# Altium project ESP_Grow_Main_Rev_A.PrjPCB
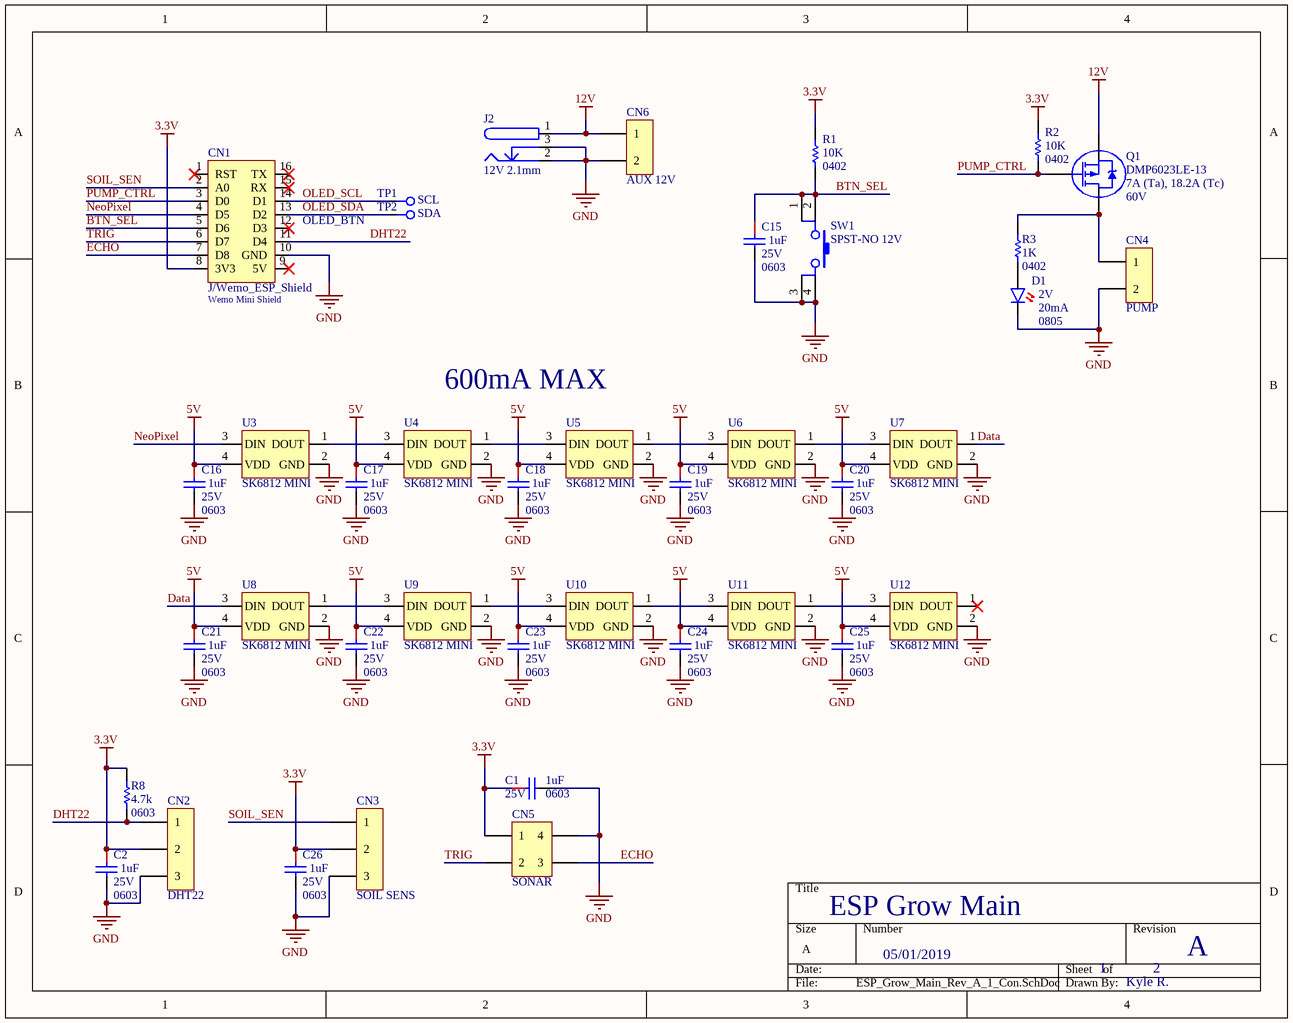
[diagram p0: ESP_Grow_Main_Rev_A_1_Con.SchDoc]
1 sheet, 40 parts. Net scope: global (net labels, ports and power ports of the same name join across sheets).
Board file: ESP_Grow_Main_Rev_A.PcbDoc

## Sheet ESP_Grow_Main_Rev_A_1_Con.SchDoc: ESP Grow Main
size A; Date: 05/01/2019; Author: Kyle R.; Revision: A; SheetNumber: 1; SheetTotal: 2

### Parts
C1  1uF  Voltage - Rated: 25V  Package / Case: 0603  [CAPC0603(1608)_N]
C2  1uF  Voltage - Rated: 25V  Package / Case: 0603  [CAPC0603(1608)_N]
C15  1uF  Voltage - Rated: 25V  Package / Case: 0603  [CAPC0603(1608)_N]
C16  1uF  Voltage - Rated: 25V  Package / Case: 0603  [CAPC0603(1608)_N]
C17  1uF  Voltage - Rated: 25V  Package / Case: 0603  [CAPC0603(1608)_N]
C18  1uF  Voltage - Rated: 25V  Package / Case: 0603  [CAPC0603(1608)_N]
C19  1uF  Voltage - Rated: 25V  Package / Case: 0603  [CAPC0603(1608)_N]
C20  1uF  Voltage - Rated: 25V  Package / Case: 0603  [CAPC0603(1608)_N]
C21  1uF  Voltage - Rated: 25V  Package / Case: 0603  [CAPC0603(1608)_N]
C22  1uF  Voltage - Rated: 25V  Package / Case: 0603  [CAPC0603(1608)_N]
C23  1uF  Voltage - Rated: 25V  Package / Case: 0603  [CAPC0603(1608)_N]
C24  1uF  Voltage - Rated: 25V  Package / Case: 0603  [CAPC0603(1608)_N]
C25  1uF  Voltage - Rated: 25V  Package / Case: 0603  [CAPC0603(1608)_N]
C26  1uF  Voltage - Rated: 25V  Package / Case: 0603  [CAPC0603(1608)_N]
CN1  J/Wemo_ESP_Shield  Name: Wemo Mini Shield  [Wemos_d1]
CN2  DHT22  [Molex 1x3 Microfit 90deg]
CN3  SOIL SENS  [Molex 1x3 Microfit 90deg]
CN4  PUMP  [Molex 1x2 Microfit 3.0]
CN5  SONAR  [Molex 2x2 Microfit 90deg]
CN6  AUX 12V  [Molex 1x2 Microfit 3.0]
D1  Voltage - Forward (Vf) (Typ): 2V  Current - Test: 20mA  Package / Case: 0805  [D/0805]  (hidden comment: D/LEDR/0805)
J2  12V 2.1mm  [CONN_PWR_JACK_2.1x5.5mm]
Q1  DMP6023LE-13  Current - Continuous Drain (Id) @ 25°C: 7A (Ta), 18.2A (Tc)  Drain to Source Voltage (Vdss): 60V  [SOT-223 - DMP6023LE]
R1  10K  Supplier Device Package: 0402  [RESC0402(1005)_N]
R2  10K  Supplier Device Package: 0402  [RESC0402(1005)_N]
R3  Package / Case: 0402  [RESC0402(1005)_L]  (hidden comment: 1K)
R8  Package / Case: 0603  [RESC0603(1608)_N]  (hidden comment: 4.7K)
SW1  SPST-NO 12V  [SW TACT Red 6mm x 6mm]
TP1  SCL  [Pogo-Testpoint]  (no BOM)
TP2  SDA  [Pogo-Testpoint]  (no BOM)
U3  SK6812 MINI  [SK6812_Mini]
U4  SK6812 MINI  [SK6812_Mini]
U5  SK6812 MINI  [SK6812_Mini]
U6  SK6812 MINI  [SK6812_Mini]
U7  SK6812 MINI  [SK6812_Mini]
U8  SK6812 MINI  [SK6812_Mini]
U9  SK6812 MINI  [SK6812_Mini]
U10  SK6812 MINI  [SK6812_Mini]
U11  SK6812 MINI  [SK6812_Mini]
U12  SK6812 MINI  [SK6812_Mini]

### Nets
3.3V: C1.1 C2.1 C26.1 CN1.8(3V3) CN2.2 CN3.2 CN5.1 R1.2 R2.2 R8.2
5V: C16.1 C17.1 C18.1 C19.1 C20.1 C21.1 C22.1 C23.1 C24.1 C25.1 U3.4(VDD) U4.4(VDD) U5.4(VDD) U6.4(VDD) U7.4(VDD) U8.4(VDD) U9.4(VDD) U10.4(VDD) U11.4(VDD) U12.4(VDD)
12V: CN6.1 J2.1 Q1.S
GND: C1.2 C2.2 C15.2 C16.2 C17.2 C18.2 C19.2 C20.2 C21.2 C22.2 C23.2 C24.2 C25.2 C26.2 CN1.10(GND) CN2.3 CN3.3 CN4.2 CN5.4 CN6.2 D1.1 J2.2 J2.3 SW1.3 SW1.4 U3.2(GND) U4.2(GND) U5.2(GND) U6.2(GND) U7.2(GND) U8.2(GND) U9.2(GND) U10.2(GND) U11.2(GND) U12.2(GND)
BTN_SEL: C15.1 CN1.5(D6) R1.1 SW1.1 SW1.2
Data: U7.1(DOUT) U8.3(DIN)
DHT22: CN1.11(D4) CN2.1 R8.1
ECHO: CN1.7(D8) CN5.3
NeoPixel: CN1.4(D5) U3.3(DIN)
OLED_SCL: CN1.14(D1) TP1.1
OLED_SDA: CN1.13(D2) TP2.1
PUMP_CTRL: CN1.3(D0) Q1.G R2.1
SOIL_SEN: CN1.2(A0) CN3.1
TRIG: CN1.6(D7) CN5.2
NetCN4_1: CN4.1 Q1.D R3.2
NetD1_2: D1.2 R3.1
NetU3_1: U3.1(DOUT) U4.3(DIN)
NetU4_1: U4.1(DOUT) U5.3(DIN)
NetU5_1: U5.1(DOUT) U6.3(DIN)
NetU6_1: U6.1(DOUT) U7.3(DIN)
NetU8_1: U8.1(DOUT) U9.3(DIN)
NetU9_1: U9.1(DOUT) U10.3(DIN)
NetU10_1: U10.1(DOUT) U11.3(DIN)
NetU11_1: U11.1(DOUT) U12.3(DIN)

Not connected (* = marked no-connect by the designer): CN1 1(RST)* 9(5V)* 12(D3)* 15(RX)* 16(TX)*; U12 1(DOUT)*

### Notes on the sheet
- (near CN1) OLED_BTN
- 600mA MAX

### Library data of the parts
C1 C2 C15-C26 = CAP CER 1UF 25V 10% X7R 0603: 1uF 0603 25V; Manufacturer: TDK Corporation; Manufacturer Part Number: CGA3E1X7R1E105K080AC; Tolerance: ±10%; Temperature Coefficient: X7R; Supplier 1: Digi-Key; RoHS: RoHS Compliant; Category: Capacitors; Stock 1: 360610; Pricing 1: 1=0.2, 10=0.135, 100=0.0686, 500=0.04696, 1000=0.04154 (USD); Packaging: Cut Tape (CT); Part Status: Active; Operating Temperature: -55°C ~ 125°C; Features: -; Ratings: AEC-Q200; Applications: Automotive; Failure Rate: -; Mounting Type: Surface Mount, MLCC; Size / Dimension: 0.063" L x 0.032" W (1.60mm x 0.80mm); Height - Seated (Max): -; Thickness (Max): 0.035" (0.90mm); Lead Spacing: -; Lead Style: -; ComponentLink1URL: https://product.tdk.com/info/en/catalog/datasheets/mlcc_automotive_general_en.pdf; ComponentLink1Description: https://product.tdk.com/info/en/catalog/datasheets/mlcc_automotive_general_en.pdf; Supplier Part Number 1: 445-6931-1-ND
CN1 = J/Wemo_ESP_Shield: Wemo Mini Shield for ESP-12
CN2 CN3 = MICROFIT 3.0 HDR 90deg 3CKT: Molex Microfit 1x3 90deg Header; Manufacturer: Molex Inc; Manufacturer Part Number: 0436500304; Connector Type: Header, Shrouded; Number of Positions: 3; Number of Positions Loaded: All; Pitch: 0.118" (3.00mm); ClassName: *; Supplier 1: Digi-Key; RoHS: RoHS Compliant; Category: Connectors, Interconnects; Stock 1: 42564; Pricing 1: 1=1.39, 10=1.224, 50=1.104, 100=1.056, 250=0.96, 500=0.864, 1000=0.768, 2500=0.696, 5000=0.672 (USD); Packaging: Tray; Contact Type: Male Pin; Number of Rows: 1; Row Spacing: -; Contact Mating Length: -; Mounting Type: Through Hole, Right Angle; Termination: Solder; Fastening Type: Locking Ramp; Features: Board Lock; Contact Finish: Gold; Contact Finish Thickness: 15µin (0.38µm); Color: Black; ComponentLink1URL: http://www.molex.com/pdm_docs/sd/436500304_sd.pdf; ComponentLink1Description: http://www.molex.com/pdm_docs/sd/436500304_sd.pdf; Supplier Part Number 1: WM1876-ND
CN4 CN6 = MICROFIT 3.0 HDR VERT CPI 2CKT: Molex Microfit 1x2 Vert Header; Manufacturer: Molex, LLC; Manufacturer Part Number: 0430450227; Shrouding: Shrouded - 4 Wall; Number of Positions: 2; Number of Positions Loaded: All; Row Spacing: 0.118" (3.00mm); Supplier 1: Digi-Key; RoHS: RoHS Compliant; Category: Connectors, Interconnects; Stock 1: 4002; Pricing 1: 1=0.8, 10=0.705, 50=0.636, 100=0.6083, 250=0.553, 500=0.4977, 1000=0.4424, 2500=0.40092, 5000=0.3871 (USD); Packaging: Tray; Part Status: Active; Connector Type: Header; Contact Type: Male Pin; Pitch: -; Number of Rows: 2; Mounting Type: Through Hole; Termination: Solder; Fastening Type: Locking Ramp; Contact Mating Length: -; Features: Board Guide; Contact Finish: Tin; Contact Finish Thickness: 60µin (1.52µm); Color: Black; ComponentLink1URL: http://www.molex.com/pdm_docs/sd/430450227_sd.pdf; ComponentLink1Description: http://www.molex.com/pdm_docs/sd/430450227_sd.pdf; Supplier Part Number 1: WM10657-ND
CN5 = MICROFIT 3.0 HDR 90deg 4CKT: Molex Microfit 2x2 90deg Header; Manufacturer: Molex Inc; Manufacturer Part Number: 0430450400; Connector Type: Header, Shrouded; Number of Positions: 4; Number of Positions Loaded: All; Pitch: 0.118" (3.00mm); ClassName: *; Supplier 1: Digi-Key; RoHS: RoHS Compliant; Category: Connectors, Interconnects; Stock 1: 9668; Pricing 1: 1=1.35, 10=1.228, 50=1.1026, 100=1.0525, 250=0.95228, 500=0.8771, 1000=0.7518, 2500=0.70168, 5000=0.6666 (USD); Packaging: Tray; Contact Type: Male Pin; Number of Rows: 2; Row Spacing: 0.118" (3.00mm); Contact Mating Length: -; Mounting Type: Through Hole, Right Angle; Termination: Solder; Fastening Type: Locking Ramp; Features: Board Lock; Contact Finish: Tin; Contact Finish Thickness: 100µin (2.54µm); Color: Black; ComponentLink1URL: http://www.molex.com/pdm_docs/sd/430450400_sd.pdf; ComponentLink1Description: http://www.molex.com/pdm_docs/sd/430450400_sd.pdf; Supplier Part Number 1: WM1814-ND
D1 = D/LEDR/0805: Red 625nm LED Indication - Discrete 2V 0805; Digikey Part: 732-4984-1-ND; Cost: 0.23; Supplier 1: Digi-Key; Supplier Part Number 1: 732-4984-6-ND
J2 = CONN PWR JACK 2.1: 2.1 mm barrel jack; Manufacturer: CUI Inc; Manufacturer Part Number: PJ-002A; Gender: Male; Plug/Mating Plug Diameter: 2.1mm ID, 5.5mm OD; Number of Positions/Contacts: 2 Conductors, 3 Contacts; Internal Switch(s): Single Switch, Normally Closed; Shielding: Unshielded; Voltage - Rated: 16VDC; Current Rating: 2.5A; Published: 17-Dec-2003; DatasheetDocument: 09-May-2002; Publisher: Altium Limited; ComponentLink1Description: Manufacturer Link; ComponentLink1URL: http://domino.kycon.com/internet/Products.html; RoHS: RoHS Compliant; Category: Connectors, Interconnects; Connector Type: Jack; Mounting Type: Through Hole, Right Angle; Termination: Solder Eyelet(s); Features: -; Color: Black; Contact Material: Copper Alloy; Contact Material - Plating: Tin; Housing Color: Black; Housing Material: Thermoplastic; Operating Temperature: -25°C ~ 85°C; ComponentLink2URL: http://www.cui.com/product/resource/digikeypdf/pj-002a.pdf; ComponentLink2Description: http://www.cui.com/product/resource/digikeypdf/pj-002a.pdf; Supplier 1: Digi-Key; Stock 1: 47553; Pricing 1: 1=1.01, 10=0.704, 100=0.4724, 500=0.3819, 1000=0.3417, 2500=0.27135 (USD); ComponentLink3URL: http://www.cui.com/product/resource/digikeypdf/pj-002ah.pdf; ComponentLink3Description: http://www.cui.com/product/resource/digikeypdf/pj-002ah.pdf; Supplier Part Number 1: CP-002AH-ND
Q1 = DMP6023LE-13: MOSFET P-CH 60V 7A SOT223; Manufacturer: Diodes Incorporated; FET Type: P-Channel; Drive Voltage (Max Rds On,  Min Rds On): 4.5V, 10V; Vgs(th) (Max) @ Id: 3V @ 250µA; Vgs (Max): ±20V; Power Dissipation (Max): 2W (Ta); Rds On (Max) @ Id, Vgs: 28 mOhm @ 5A, 10V; Supplier 1: Digi-Key; Manufacturer Part Number: DMP6023LE-13; RoHS: RoHS Compliant; Category: Discrete Semiconductor Products; Stock 1: 16540; Pricing 1: 1=0.95, 10=0.829, 100=0.6396, 500=0.4738, 1000=0.37904 (USD); Packaging: Cut Tape (CT); Part Status: Active; Technology: MOSFET (Metal Oxide); FET Feature: -; Operating Temperature: -55°C ~ 150°C (TJ); Mounting Type: Surface Mount; Supplier Device Package: SOT-223; Package / Case: TO-261-4, TO-261AA; ComponentLink1URL: https://www.diodes.com/assets/Datasheets/DMP6023LE.pdf; ComponentLink1Description: https://www.diodes.com/assets/Datasheets/DMP6023LE.pdf; Supplier Part Number 1: DMP6023LE-13DICT-ND
R1 R2 = RES 10K OHM 1% 1/16W 0402: 10K 0402; Manufacturer: Samsung Electro-Mechanics; Manufacturer Part Number: RC1005F103CS; Tolerance: ±1%; Power (Watts): 0.063W, 1/16W; Temperature Coefficient: ±100ppm/°C; Supplier 1: Digi-Key; RoHS: RoHS Compliant; Category: Resistors; Stock 1: 25834562; Pricing 1: 1=0.1, 10=0.021, 100=0.0086, 1000=0.00385, 2500=0.00334, 5000=0.00276 (USD); Packaging: Cut Tape (CT); Part Status: Active; Composition: Thick Film; Features: Moisture Resistant; Operating Temperature: -55°C ~ 155°C; Package / Case: 0402 (1005 Metric); Size / Dimension: 0.039" L x 0.020" W (1.00mm x 0.50mm); Height - Seated (Max): 0.016" (0.40mm); Failure Rate: -; ComponentLink1URL: http://www.samsungsem.com/kr/support/product-search/chip-resistor/RC1005F103CS.jsp; ComponentLink1Description: http://www.samsungsem.com/kr/support/product-search/chip-resistor/RC1005F103CS.jsp; Supplier Part Number 1: 1276-3431-1-ND
R3 = RES 1K OHM 1% 1/16W 0402: 1K 0402; Manufacturer: Yageo; Manufacturer Part Number: RC0402FR-071KL; Tolerance: 1%; Temperature Coefficient: 100ppm/°C; Power Rating: 62.5mW; Voltage Rating: 50V; ComponentLink1URL: https://datasheet.ciiva.com/2453/pyu-r-int-thick-7-2453361.pdf; ComponentLink1Description: https://datasheet.ciiva.com/2453/pyu-r-int-thick-7-2453361.pdf; ComponentLink2URL: https://datasheet.ciiva.com/2453/pyu-r-int-thick-7-2453362.pdf; ComponentLink2Description: https://datasheet.ciiva.com/2453/pyu-r-int-thick-7-2453362.pdf; ComponentLink3URL: https://datasheet.ciiva.com/2453/pyu-r-int-thick-7-2453363.pdf; ComponentLink3Description: https://datasheet.ciiva.com/2453/pyu-r-int-thick-7-2453363.pdf; ComponentLink4URL: https://datasheet.ciiva.com/22747/1018594-22747509.pdf; ComponentLink4Description: https://datasheet.ciiva.com/22747/1018594-22747509.pdf; ComponentLink5URL: https://datasheet.ciiva.com/15189/getdatasheetpartid-323696-15189334.pdf; ComponentLink5Description: https://datasheet.ciiva.com/15189/getdatasheetpartid-323696-15189334.pdf; ComponentLink6URL: https://datasheet.ciiva.com/16740/pyu-rc0402-51-rohs-l-6-r-16740567.pdf; ComponentLink6Description: https://datasheet.ciiva.com/16740/pyu-rc0402-51-rohs-l-6-r-16740567.pdf; ComponentLink7URL: https://datasheet.ciiva.com/12667/pyu-rc0402-51-rohs-l-6-r-12667930.pdf; ComponentLink7Description: https://datasheet.ciiva.com/12667/pyu-rc0402-51-rohs-l-6-r-12667930.pdf; ComponentLink8URL: https://datasheet.ciiva.com/11819/0900766b80c66297-11819452.pdf; ComponentLink8Description: https://datasheet.ciiva.com/11819/0900766b80c66297-11819452.pdf; Supplier 1: Digi-Key; Supplier Part Number 1: 311-1.00KLRCT-ND; Stock 1: 21888659; Pricing 1: 1=0.1, 10=0.014, 100=0.0056, 1000=0.0025, 2500=0.0022, 5000=0.0018 (USD); Case/Package: 0402; Number of Pins: 2; Case Code (Imperial): 0402; Case Code (Metric): 1005; Min Operating Temperature: -55°C; Max Operating Temperature: 155°C; Packaging: Tape and Reel; Composition: Thick Film; Voltage Rating (DC): 50V; Termination: SMD/SMT; Military Standard: Not; Length: 1mm; Height: 0.32mm; Width: 0.5mm; Depth: 0.5mm; REACH SVHC: Unknown; Lead Free: Lead Free; ComponentLink9URL: https://datasheet.ciiva.com/11819/0900766b80c66297-11819477.pdf; ComponentLink9Description: https://datasheet.ciiva.com/11819/0900766b80c66297-11819477.pdf; ComponentLink10URL: https://datasheet.ciiva.com/12666/pyu-rc0402-51-rohs-l-6-r-12666741.pdf; ComponentLink10Description: https://datasheet.ciiva.com/12666/pyu-rc0402-51-rohs-l-6-r-12666741.pdf; ComponentLink11URL: https://datasheet.ciiva.com/17063/pyu-rc0402-51-rohs-l-6-r-17063193.pdf; ComponentLink11Description: https://datasheet.ciiva.com/17063/pyu-rc0402-51-rohs-l-6-r-17063193.pdf; ComponentLink12URL: https://datasheet.ciiva.com/22747/1018594-22747513.pdf; ComponentLink12Description: https://datasheet.ciiva.com/22747/1018594-22747513.pdf; ComponentLink13URL: https://datasheet.ciiva.com/7849/1018594-7849869.pdf; ComponentLink13Description: https://datasheet.ciiva.com/7849/1018594-7849869.pdf; ComponentLink14URL: https://datasheet.ciiva.com/7983/1018594-7983502.pdf; ComponentLink14Description: https://datasheet.ciiva.com/7983/1018594-7983502.pdf; ComponentLink15URL: https://datasheet.ciiva.com/7849/1018594-7849871.pdf; ComponentLink15Description: https://datasheet.ciiva.com/7849/1018594-7849871.pdf; Category: Resistors; Resistance: 1K
R8 = RES 4.7K OHM 1/10W 5% 0603 SMD: 4.7K 0603; Manufacturer: Panasonic Electronic Components; Manufacturer Part Number: ERJ-3GEYJ472V; Tolerance: ±5%; Power (Watts): 0.1W, 1/10W; Temperature Coefficient: ±200ppm/°C; Supplier 1: Digi-Key; RoHS: RoHS Compliant; Category: Resistors; Stock 1: 1261582; Pricing 1: 1=0.1, 50=0.0126, 100=0.0096, 250=0.00716, 500=0.00528, 1000=0.00352, 2500=0.00297 (USD); Packaging: Cut Tape (CT); Resistance (Ohms): 4.7k; Composition: Thick Film; Features: Automotive AEC-Q200 Qualified; Supplier Device Package: 0603; Size / Dimension: 0.063" L x 0.031" W (1.60mm x 0.80mm); Height: 0.022" (0.55mm); Number of Terminations: 2; ComponentLink1URL: http://industrial.panasonic.com/www-cgi/jvcr13pz.cgi?E+PZ+3+AOA0001+ERJ3GEYJ472V+7+WW; ComponentLink1Description: http://industrial.panasonic.com/www-cgi/jvcr13pz.cgi?E+PZ+3+AOA0001+ERJ3GEYJ472V+7+WW; Supplier Part Number 1: P4.7KGCT-ND
SW1 = PTS645SM43SMTR92 LFS: SWITCH TACTILE SPST-NO 0.05A 12V; Manufacturer: C&K; Switch Function: Off-Mom; Contact Rating @ Voltage: 0.05A @ 12VDC; Actuator Type: Standard; Actuator Height off PCB, Vertical: 4.30mm; Actuator Orientation: Top Actuated; Outline: 6.00mm x 6.00mm; Illumination: Non-Illuminated; Operating Force: 160gf; Actuator Material: Polyamide (PA66), Nylon 6/6; Mechanical Life: 100,000 Cycles; ClassName: *; Supplier 1: Digi-Key; Manufacturer Part Number: PTS645SM43SMTR92 LFS; RoHS: RoHS Compliant; Category: Switches; Stock 1: 234699; Pricing 1: 1=0.15, 10=0.147, 25=0.1416, 50=0.1366, 100=0.129, 250=0.12144, 500=0.11638 (USD); Packaging: Cut Tape (CT); Part Status: Active; Circuit: SPST-NO; Mounting Type: Surface Mount; Actuator Length, Right Angle: -; Termination Style: Gull Wing; Illumination Type, Color: -; Illumination Voltage (Nominal): -; Ingress Protection: -; Features: Blue Actuator; Switch Travel: -; Operating Temperature: -20°C ~ 60°C; ComponentLink1URL: http://www.ckswitches.com/media/1471/pts645.pdf; ComponentLink1Description: http://www.ckswitches.com/media/1471/pts645.pdf; Supplier Part Number 1: CKN9112CT-ND
TP1 TP2 = CMP-001-0557-03: Test Point- Current one; Pin Count: 1; Component Name: TestPoint; Designator: TestPoint
U3-U12 = U/SK6812MINI: Serial RGB LED SMT5050